# Altium project main_io.PrjPcb (part 6 of 6)
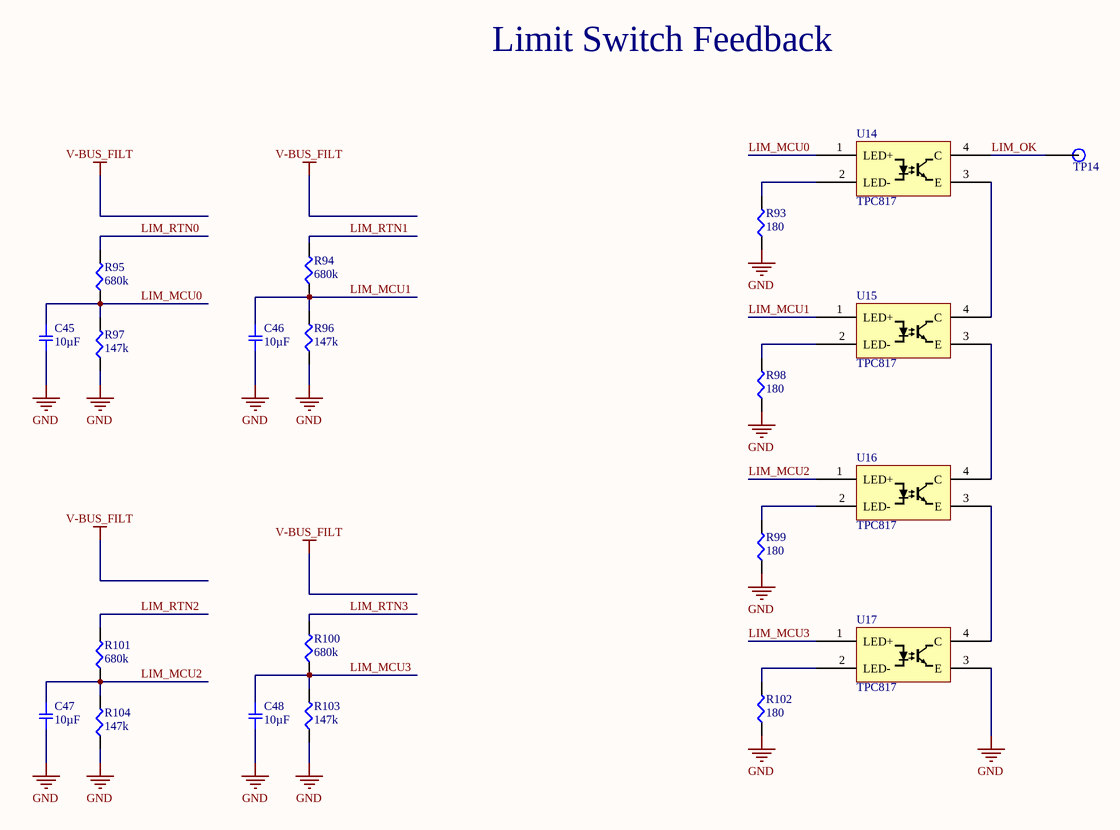
[diagram p19: limit_switches.SchDoc]

## Nets that join several sheets
GND: connectors (37 pins), beaglebone (12 pins), bus_filter (8 pins), power_5V (22 pins), power_12V (18 pins), can_uart (21 pins), retros (11 pins), bms_interface (6 pins), motor_controller_interface (7 pins), RTC (13 pins), shutdown_circuit (22 pins), adc (20 pins), battery_interface (10 pins), misc_sensors (29 pins), batt_protection (18 pins), gpio (12 pins), limit_switches (13 pins)
MSTR_SW +: connectors (19 pins), bus_filter (R58.2 R61.1 TP10.1 U8.1), power_5V (6 pins), power_12V (C75.1 C76.1 C77.1 U23.2), retros (R164.1 R167.1 R174.1 R177.1), bms_interface (7 pins), motor_controller_interface (D21.2 F14.2 K7.1), shutdown_circuit (10 pins), battery_interface (8 pins)
V-BUS_PROT: bus_filter (L2.1 R57.1 TP8.1), batt_protection (F1.2 F2.2 R23.2 TP3.1)
V-POS3.3V: connectors (P27.1), beaglebone (8 pins), can_uart (C36.2 U10.5), retros (12 pins), RTC (C87.2 C88.1 U30.2), misc_sensors (C57.1 U18.2), gpio (R69.2 R81.2)
V-POS5V: connectors (P28.1), beaglebone (5 pins), bus_filter (C28.2 U8.3 U8.6), power_5V (10 pins), power_12V (C82.2 U24.3 U24.6), can_uart (6 pins), motor_controller_interface (P43.2), RTC (R180.2 R181.2), shutdown_circuit (S2.1), adc (24 pins), misc_sensors (9 pins), gpio (10 pins)
V-POS12V: connectors (P29.1), power_12V (5 pins), bms_interface (F?#2.1), motor_controller_interface (F13.2), misc_sensors (R109.2 R121.2 R129.2)
VPOS-24V_RAW: battery_interface (P3.1), batt_protection (12 pins)
12V_SPLY_EN: power_12V (U23.3), gpio (U13.28)
32kHz: RTC (R180.1 U30.1), gpio (U13.7)
ADC_EXTRA0: adc (U2.10), misc_sensors (C52.1 R114.2 TP22.1)
ADC_EXTRA1: adc (U2.9), misc_sensors (C56.1 R125.2 TP30.1)
ADC_EXTRA2: adc (U4.10), misc_sensors (C58.1 R134.2 TP32.1)
ANLG_EXC_0: connectors (P33.8), misc_sensors (R108.1 R109.1 TP21.1)
ANLG_EXC_1: connectors (P33.2 P33.5), misc_sensors (R120.1 R121.1 TP29.1)
ANLG_RTN_0: connectors (P33.4), misc_sensors (D15.1 R113.2)
BATT0_DISABLE: battery_interface (Q4.1 R32.2), gpio (U13.24)
BATT1_DISABLE: battery_interface (Q3.1 R31.2), gpio (U13.25)
BATT2_DISABLE: battery_interface (Q5.1 R33.2), gpio (U13.26)
BATT3_DISABLE: battery_interface (Q6.1 R34.2), gpio (U13.27)
BMS_MPI1: bms_interface (P?#3.10), gpio (U12.27)
BMS_MPO1: bms_interface (LED.2 P?#1.1 P?#2.1 P?#3.2), shutdown_circuit (K10.7)
BMS_STAT_FDBK: shutdown_circuit (R189.2 R190.1), gpio (U12.6)
BRK0_PWR_HRN: connectors (P24.1), gpio (U13.3)
BRK0_UART_HRN: connectors (P22.5), gpio (U13.1)
BRK1_PWR_HRN: connectors (P26.1), gpio (U13.4)
BRK1_UART_HRN: connectors (P25.5), gpio (U13.2)
CAN1_H: can_uart (P21.1 R65.1 U10.7), bms_interface (P?#5.1 R?#4.2 S?.5), motor_controller_interface (R136.2)
CAN1_L: can_uart (P20.1 R66.1 U10.6), bms_interface (P?#5.3 R?#3.2 R?#5.2), motor_controller_interface (R137.2)
CAN1_RXD: beaglebone (U6.24), can_uart (P18.1 U10.4)
CAN1_TXD: beaglebone (U6.26), can_uart (P19.1 U10.1)
E-STOP +: connectors (P35.2 P36.1), shutdown_circuit (P44.2 P45.1 R191.1 R194.1)
E-STOP -: connectors (P35.1), shutdown_circuit (5 pins)
E_STOP_FDBK: shutdown_circuit (R196.2 R197.1), gpio (U12.4)
GPIO0_RST_n: beaglebone (U6.108), gpio (R69.1 R77.2 U12.18)
GPIO1_RST_n: beaglebone (U6.110), gpio (R81.1 R89.2 U13.18)
HB_OUT: connectors (D11.1 P22.1 P25.1), beaglebone (U7.1)
High_Contactor_Aux: connectors (P23.1), gpio (U13.21)
HV_CHRG/DCHRG_EN: bms_interface (P?#3.12 P?#3.13), shutdown_circuit (K9.7)
I2C1_SCL: beaglebone (P10.2 R39.1), retros (R168.1), RTC (R179.1), adc (R9.2 R20.2), misc_sensors (R127.1), gpio (R74.2 R86.2)
I2C1_SDA: beaglebone (P10.1 R40.2), retros (R169.1), RTC (R182.1), adc (R8.2 R19.2), misc_sensors (R130.1), gpio (R73.2 R85.2)
I2C2_SCL: beaglebone (P11.2 R41.1), retros (R171.1), RTC (R183.1), adc (R7.2 R18.2), misc_sensors (R133.1), gpio (R75.2 R87.2)
I2C2_SDA: beaglebone (P11.1 R42.2), retros (R172.1), RTC (R184.1), adc (R6.2 R17.2), misc_sensors (R131.1), gpio (R76.2 R88.2)
IMD_STAT_FDBK: shutdown_circuit (R201.2 R202.1), gpio (U12.7)
Inertia_Switch +: connectors (P35.4), shutdown_circuit (5 pins)
Inertia_Switch -: connectors (P35.3), shutdown_circuit (5 pins)
INRT_STAT_FDBK: shutdown_circuit (R203.2 R204.1), gpio (U12.8)
INT_SQW: RTC (R181.1 U30.3), gpio (U13.8)
LIM_MCU0: gpio (U12.26), limit_switches (C45.1 R95.1 R97.2 U14.1)
LIM_MCU1: gpio (U12.25), limit_switches (C46.1 R94.1 R96.2 U15.1)
LIM_MCU2: gpio (U12.24), limit_switches (C47.1 R101.1 R104.2 U16.1)
LIM_MCU3: gpio (U12.23), limit_switches (C48.1 R100.1 R103.2 U17.1)
LIM_OK: shutdown_circuit (D28.1 K8.8), limit_switches (TP14.1 U14.4)
LIM_RTN0: connectors (P39.1), limit_switches (R95.2)
LIM_RTN1: connectors (P39.2), limit_switches (R94.2)
LIM_RTN2: connectors (P40.1), limit_switches (R101.2)
LIM_RTN3: connectors (P40.2), limit_switches (R100.2)
LMT_SW_FDBK: shutdown_circuit (R187.2 R188.1), gpio (U12.5)
Low_Contactor_Aux: connectors (P23.2), gpio (U13.22)
Low_Contactor_DRV: connectors (P23.6), shutdown_circuit (7 pins)
MCU_HV_EN: shutdown_circuit (U33.1), gpio (U12.2)
MCU_Latch: shutdown_circuit (S2.2 U31.1 U32.1), gpio (U12.1)
MCU_PUMP_PWR: motor_controller_interface (P43.1 U19.1), gpio (U13.23)
MCU_STAT_FDBK: shutdown_circuit (R205.2 R206.1), gpio (U12.28)
MSTR_SW_FDBK: shutdown_circuit (R194.2 R195.1), gpio (U12.3)
PRECHG_HRN: connectors (R67.1 R68.2), gpio (U13.5)
RETRO_0_MCU: connectors (P32.7), beaglebone (U6.112), retros (R162.1 R163.1 TP45.1 U25.4)
RETRO_1_MCU: connectors (P32.6), beaglebone (U6.114), retros (R165.1 R166.1 TP47.1 U26.4)
RETRO_2_MCU: connectors (P32.5), beaglebone (U6.116), retros (R170.1 R173.1 TP52.1 U28.4)
RETRO_WHEEL_MCU: beaglebone (U6.30), retros (R178.2 TP51.1 TP54.1 U27.3)
RETRO_WHEEL_SIG: connectors (P34.3), retros (D27.1 TP55.1 U29.2)
RMS_Contactor_SIG: connectors (P23.7), motor_controller_interface (P41.6)
RMS_Precharge_SIG: connectors (P23.8), motor_controller_interface (P41.2)
RTC_RST_n: RTC (U30.4), gpio (U13.6)
TELEM_I_5V: power_5V (C70.1 R144.2 TP38.1), adc (U2.14)
TELEM_I_12V: power_12V (C81.1 R156.2 TP43.1), adc (U2.13)
TELEM_I_24V: bus_filter (C27.1 R59.2 TP11.1), adc (U2.16)
TELEM_THERM_0: adc (U4.16), misc_sensors (C50.1 R111.2 TP19.1)
TELEM_THERM_1: adc (U4.15), misc_sensors (C51.1 R112.2 TP20.1)
TELEM_THERM_2: adc (U4.14), misc_sensors (C49.1 R110.2 TP18.1)
TELEM_THERM_3: adc (U4.13), misc_sensors (C55.1 R123.2 TP28.1)
TELEM_THERM_4: adc (U4.12), misc_sensors (C54.1 R122.2 TP27.1)
TELEM_THERM_5: adc (U4.11), misc_sensors (C53.1 R119.2 TP26.1)
TELEM_V_5V: power_5V (C73.1 R147.2), adc (U2.11)
TELEM_V_12V: power_12V (C83.1 R159.2), adc (U2.12)
TELEM_V_24V: bus_filter (C29.1 R62.2 TP12.1), adc (U2.15)
THERM_OUT_0: connectors (P31.4), misc_sensors (5 pins)
THERM_OUT_1: connectors (P31.3), misc_sensors (5 pins)
THERM_OUT_2: connectors (P37.4), misc_sensors (5 pins)
THERM_OUT_3: connectors (P37.3), misc_sensors (5 pins)
THERM_OUT_4: connectors (P38.4), misc_sensors (5 pins)
THERM_OUT_5: connectors (P38.3), misc_sensors (5 pins)
UART2_RXD: beaglebone (P9.2 U6.22), can_uart (U9.12)
UART2_TXD: beaglebone (P9.1 U6.21), can_uart (U9.11)
UART4_RXD: beaglebone (P8.2 U6.11), can_uart (U11.12)
UART4_TXD: beaglebone (P8.1 U6.13), can_uart (U11.11)
UART_RXD_RS232_0: connectors (P22.3), can_uart (D8.2 U9.13)
UART_RXD_RS232_1: connectors (P25.3), can_uart (D10.2 U11.13)
UART_TXD_RS232_0: connectors (P22.2), can_uart (D7.2 U9.14)
UART_TXD_RS232_1: connectors (P25.2), can_uart (D9.2 U11.14)